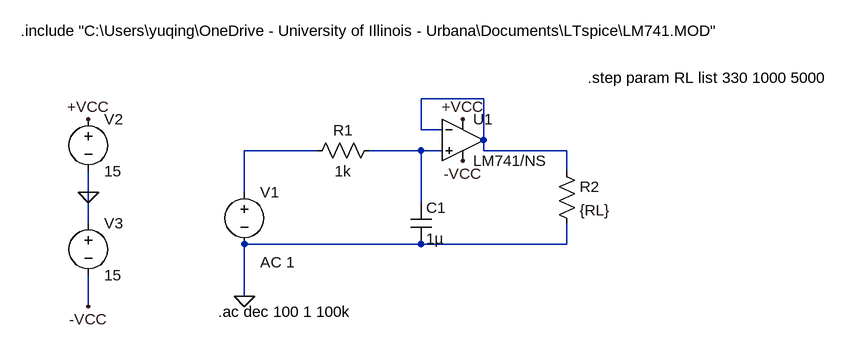
[diagram p0: schematic Lab1.3.asc]
Lab1.3.asc, the LTspice schematic file:
Version 4
SHEET 1 1012 680
WIRE 448 -32 352 -32
WIRE 352 16 352 -32
WIRE 384 16 352 16
WIRE 448 32 448 -32
WIRE 192 48 80 48
WIRE 352 48 272 48
WIRE 384 48 352 48
WIRE 448 48 448 32
WIRE 576 48 448 48
WIRE 576 80 576 48
WIRE -160 112 -160 80
WIRE 80 112 80 48
WIRE 352 128 352 48
WIRE -160 160 -160 112
WIRE 352 192 80 192
WIRE 576 192 576 160
WIRE 576 192 352 192
WIRE 80 272 80 192
WIRE -160 288 -160 240
FLAG 80 272 0
FLAG -160 112 0
FLAG -160 288 -VCC
FLAG -160 0 +VCC
FLAG 416 0 +VCC
FLAG 416 64 -VCC
SYMBOL voltage 80 96 R0
WINDOW 3 24 96 Invisible 2
WINDOW 123 24 124 Left 2
SYMATTR InstName V1
SYMATTR Value ""
SYMATTR Value2 AC 1
SYMBOL res 288 32 R90
WINDOW 0 0 56 VBottom 2
WINDOW 3 32 56 VTop 2
SYMATTR InstName R1
SYMATTR Value 1k
SYMBOL cap 336 128 R0
SYMATTR InstName C1
SYMATTR Value 1µ
SYMBOL res 560 64 R0
SYMATTR InstName R2
SYMATTR Value {RL}
SYMBOL OpAmps\\opamp2 416 -32 R0
SYMATTR InstName U1
SYMATTR Value LM741/NS
SYMBOL voltage -160 -16 R0
WINDOW 123 0 0 Left 0
WINDOW 39 0 0 Left 0
SYMATTR InstName V2
SYMATTR Value 15
SYMBOL voltage -160 144 R0
WINDOW 123 0 0 Left 0
WINDOW 39 0 0 Left 0
SYMATTR InstName V3
SYMATTR Value 15
TEXT 40 296 Left 2 !.ac dec 100 1 100k
TEXT -264 -136 Left 2 !.include "C:\\Users\\yuqing\\OneDrive - University of Illinois - Urbana\\Documents\\LTspice\\LM741.MOD"
TEXT 608 -64 Left 2 !.step param RL list 330 1000 5000

The netlist it stands for:
* Lab1.3.asc
V1 N002 0 AC 1
R1 N003 N002 1k
C1 N003 0 1µ
R2 N001 0 {RL}
XU1 N003 N001 +VCC -VCC N001 LM741/NS  ; pins In+ In- V+ V- OUT
V2 +VCC 0 15
V3 0 -VCC 15
.ac dec 100 1 100k
.include "C:\Users\yuqing\OneDrive - University of Illinois - Urbana\Documents\LTspice\LM741.MOD"
.step param RL list 330 1000 5000
.backanno
.end